# EAGLE design Escorna_CPU_2_01 (EAGLE 6.4)
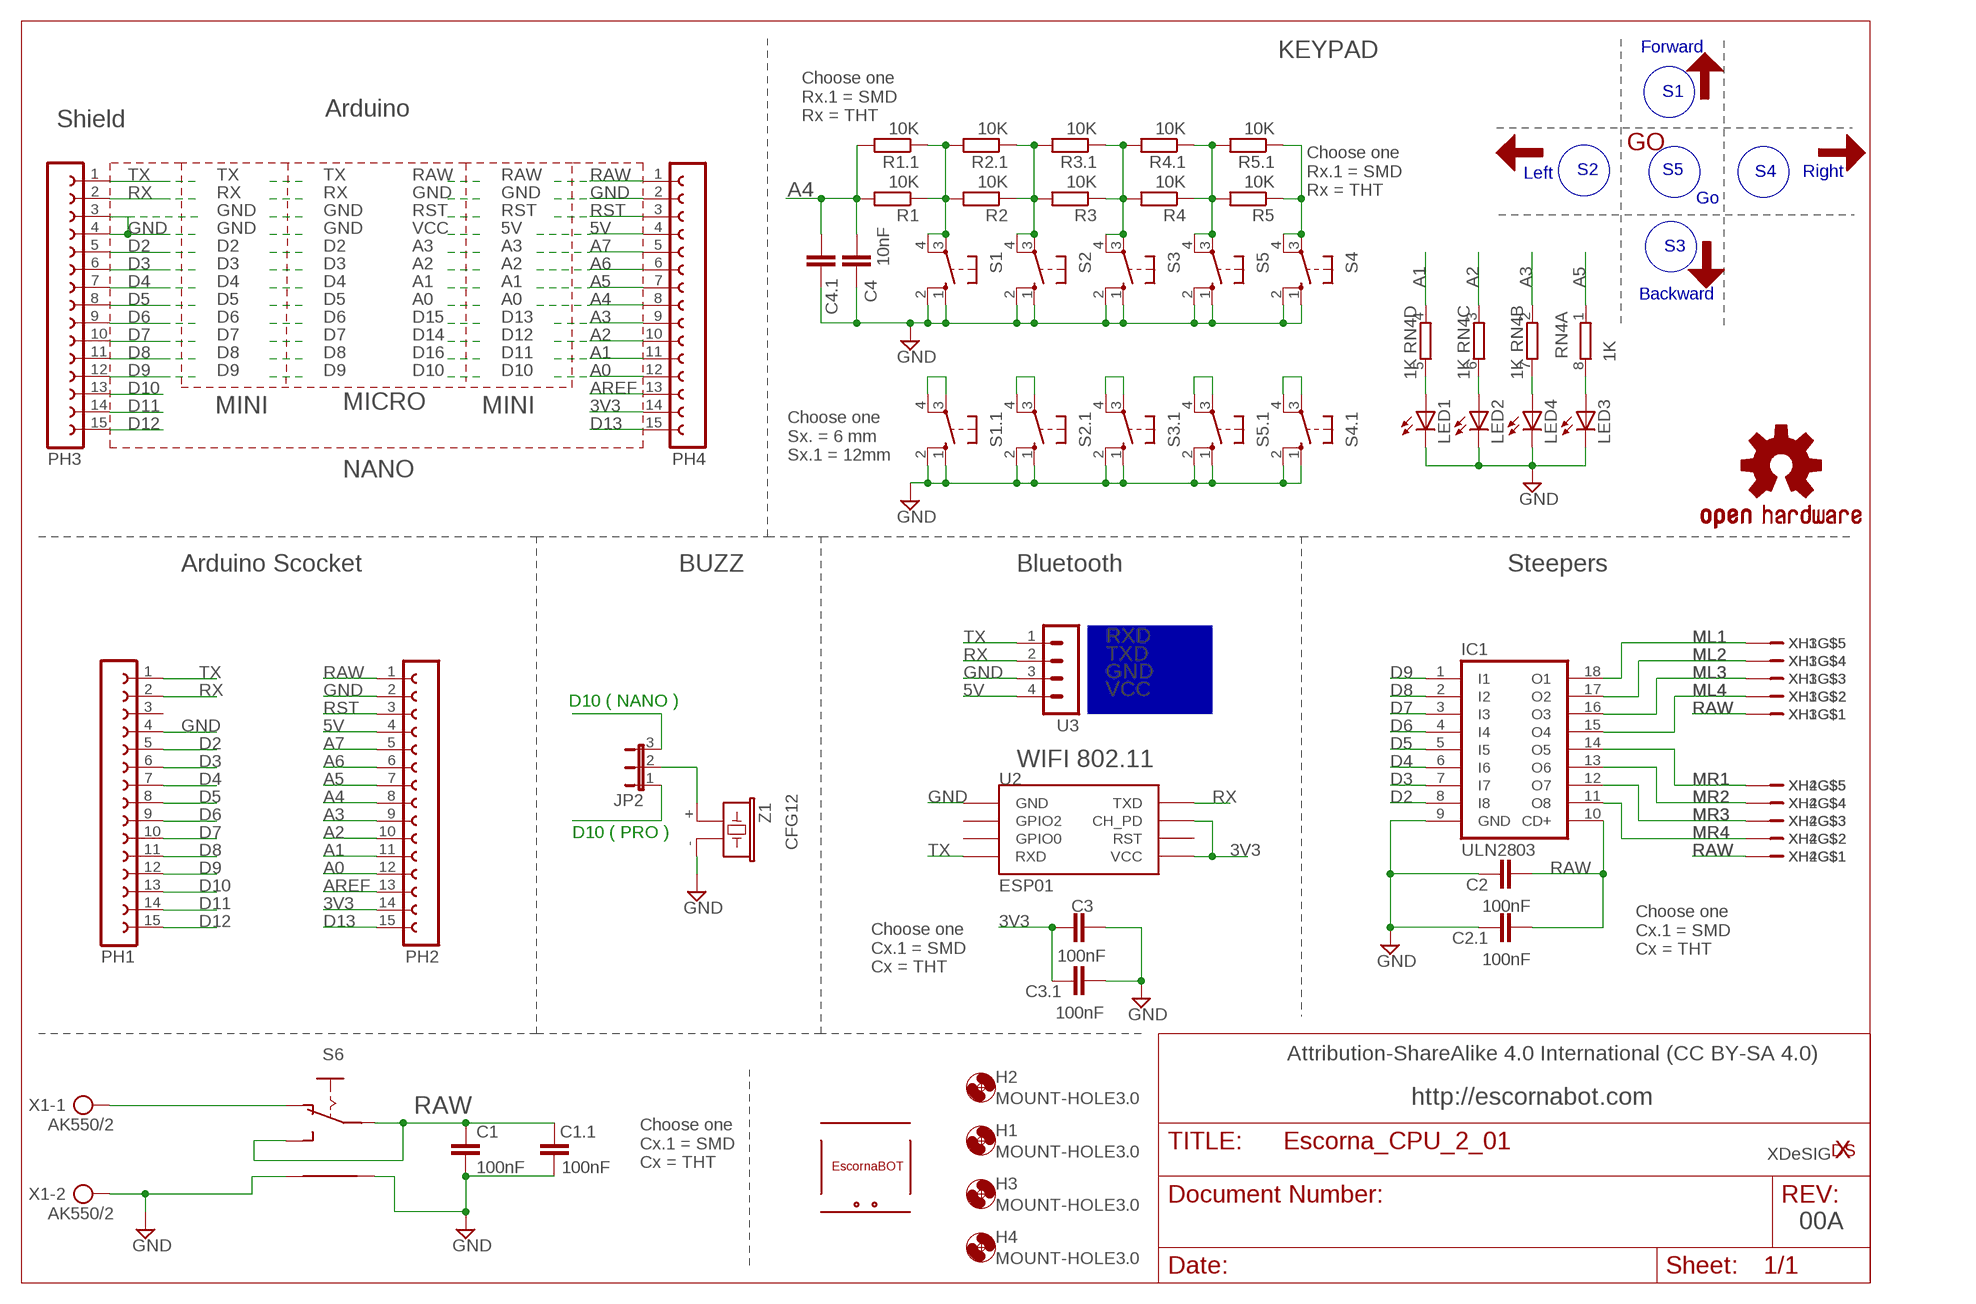
[diagram p0: schematic, sheet 1]

## Parts
C1  100nF  C-EU025-025X050  [C025-025X050]
C1.1  100nF  C-EUC0603  [C0603]
C2  100nF  C-EU025-025X050  [C025-025X050]
C2.1  100nF  C-EUC0603  [C0603]
C3  100nF  C-EU025-025X050  [C025-025X050]
C3.1  100nF  C-EUC0603  [C0603]
C4  10nF  C-EU025-025X050  [C025-025X050]
C4.1  10nF  C-EUC0603  [C0603]
ESC  ESCORNABOT  [ESCORNA_PEQUE]
H1  MOUNT-HOLE3.0  [3,0]
H2  MOUNT-HOLE3.0  [3,0]
H3  MOUNT-HOLE3.0  [3,0]
H4  MOUNT-HOLE3.0  [3,0]
IC1  ULN2803  ULN2803A"  [DIL18]
JP2  JP2E  [JP2]
LED1  LED_ESML0603  [LED_SML0603]
LED2  LED_ESML0603  [LED_SML0603]
LED3  LED_ESML0603  [LED_SML0603]
LED4  LED_ESML0603  [LED_SML0603]
LOGO2  OSHW-LOGOS  [OSHW-LOGO-S]
PH1  FE15-1  [FE15]
PH2  FE15-1  [FE15]
PH3  FE15-1  [FE15]
PH4  FE15-1  [FE15]
R1  10K  R-EU_0204/7  [0204/7]
R1.1  10K  R-EU_R0603  [R0603]
R2  10K  R-EU_0204/7  [0204/7]
R2.1  10K  R-EU_R0603  [R0603]
R3  10K  R-EU_0204/7  [0204/7]
R3.1  10K  R-EU_R0603  [R0603]
R4  10K  R-EU_0204/7  [0204/7]
R4.1  10K  R-EU_R0603  [R0603]
R5  10K  R-EU_0204/7  [0204/7]
R5.1  10K  R-EU_R0603  [R0603]
RN4  1K  4R-NCAY16  [CAY16]
S1  10-XX  [B3F-10XX]
S1.1  SWITCH-OMRON_40-XX  [SWITCH-OMRON_B3F40XX_NH]
S2  10-XX  [B3F-10XX]
S2.1  SWITCH-OMRON_40-XX  [SWITCH-OMRON_B3F40XX_NH]
S3  10-XX  [B3F-10XX]
S3.1  SWITCH-OMRON_40-XX  [SWITCH-OMRON_B3F40XX_NH]
S4  10-XX  [B3F-10XX]
S4.1  SWITCH-OMRON_40-XX  [SWITCH-OMRON_B3F40XX_NH]
S5  10-XX  [B3F-10XX]
S5.1  SWITCH-OMRON_40-XX  [SWITCH-OMRON_B3F40XX_NH]
S6  SK12F14D  [SK-12D07]
U2  ESP01  [ESP01]
U3  MA04-1  [MA04-1]
U$1  FRECHA  [FRECHA]
U$2  GO  [VALE]
U$3  FRECHA  [FRECHA]
U$6  FRECHA  [FRECHA]
U$11  FRECHA  [FRECHA]
X1  AK550/2  [AK550/2]
XDS1  XDESIG  [XDESIG_CU_2]
XH1  B5B-XH-A  [B5B-XH-A]
XH2  B5B-XH-A  [B5B-XH-A]
XH3  B5B-XH-A  [B5B-XH-A]
XH4  B5B-XH-A  [B5B-XH-A]
Z1  CFG12  F/CM12P  [F/CM12P]

## Nets
3V3: C3.1 C3.1.1 PH2.14 PH4.14 U2.CH_PD U2.VCC
5V: PH2.4 PH4.4 U3.4
A0: JP2.1 PH2.12 PH4.12
A1: PH2.11 PH4.11 RN4.4
A2: PH2.10 PH4.10 RN4.3
A3: PH2.9 PH4.9 RN4.2
A4: C4.1.2 C4.2 PH2.8 PH4.8 R1.1.2 R1.2
A5: PH2.7 PH4.7 RN4.1
A6: PH2.6 PH4.6
A7: PH2.5 PH4.5
AREF: PH2.13 PH4.13
D2: IC1.8(I8) PH1.5 PH3.5
D3: IC1.7(I7) PH1.6 PH3.6
D4: IC1.6(I6) PH1.7 PH3.7
D5: IC1.5(I5) PH1.8 PH3.8
D6: IC1.4(I4) PH1.9 PH3.9
D7: IC1.3(I3) PH1.10 PH3.10
D8: IC1.2(I2) PH1.11 PH3.11
D9: IC1.1(I1) PH1.12 PH3.12
D10: JP2.3 PH1.13 PH3.13
D11: PH1.14 PH3.14
D12: PH1.15 PH3.15
D13: PH2.15 PH4.15
GND: C1.1.1 C1.2 C2.1 C2.1.1 C3.1.2 C3.2 C4.1 C4.1.1 IC1.9(GND) LED1.C LED2.C LED3.C LED4.C PH1.4 PH2.2 PH3.3 PH3.4 PH4.2 S1.1(S) S1.1.1(S) S1.1.2(S1) S1.2(S1) S2.1(S) S2.1.1(S) S2.1.2(S1) S2.2(S1) S3.1(S) S3.1.1(S) S3.1.2(S1) S3.2(S1) S4.1(S) S4.1.1(S) S4.1.2(S1) S4.2(S1) S5.1(S) S5.1.1(S) S5.1.2(S1) S5.2(S1) S6.P$4 S6.P$5 U2.GND U3.3 X1.2 Z1.-
ML1: IC1.18(O1) XH1.P$5 XH3.P$5
ML2: IC1.17(O2) XH1.P$4 XH3.P$4
ML3: IC1.16(O3) XH1.P$3 XH3.P$3
ML4: IC1.15(O4) XH1.P$2 XH3.P$2
MR1: IC1.14(O5) XH2.P$5 XH4.P$5
MR2: IC1.13(O6) XH2.P$4 XH4.P$4
MR3: IC1.12(O7) XH2.P$3 XH4.P$3
MR4: IC1.11(O8) XH2.P$2 XH4.P$2
N$2: JP2.2 Z1.+
N$3: S6.P$2(O) X1.1
N$4: LED1.A RN4.5
N$5: LED2.A RN4.6
N$6: LED4.A RN4.7
N$7: LED3.A RN4.8
RAW: C1.1 C1.1.2 C2.1.2 C2.2 IC1.10(CD+) PH2.1 PH4.1 S6.P$1(P) S6.P$3(S) XH1.P$1 XH2.P$1 XH3.P$1 XH4.P$1
RST: PH2.3 PH4.3
RX: PH1.2 PH3.2 U2.TX(TXD) U3.2
S1: R1.1 R1.1.1 R2.1.2 R2.2 S1.1.3(P) S1.1.4(P1) S1.3(P) S1.4(P1)
S2: R2.1 R2.1.1 R3.1.2 R3.2 S2.1.3(P) S2.1.4(P1) S2.3(P) S2.4(P1)
S3: R3.1 R3.1.1 R4.1.2 R4.2 S3.1.3(P) S3.1.4(P1) S3.3(P) S3.4(P1)
S4: R4.1 R4.1.1 R5.1.2 R5.2 S5.1.3(P) S5.1.4(P1) S5.3(P) S5.4(P1)
S5: R5.1 R5.1.1 S4.1.3(P) S4.1.4(P1) S4.3(P) S4.4(P1)
TX: PH1.1 PH3.1 U2.RX(RXD) U3.1
Unconnected: PH1.3 U2.GPIO0 U2.GPIO2 U2.RST

## Notes on the sheet
- Forward
- KEYPAD
- S1
- Arduino
- Shield
- Choose one
  Rx.1 = SMD
  Rx = THT
- Left | S2 | S5 | S4 | Right
- TX | TX | RAW | RAW
- RX | RX | GND | GND
- Go
- Choose one
  Rx.1 = SMD
  Rx = THT
- GND | GND | RST | RST
- GND | GND | VCC | 5V
- D2 | D2 | A3 | A3 | S3
- D3 | D3 | A2 | A2
- D4 | D4 | A1 | A1
- Backward
- D5 | D5 | A0 | A0
- D6 | D6 | D15 | D13
- D7 | D7 | D14 | D12
- D8 | D8 | D16 | D11
- D9 | D9 | D10 | D10
- MINI | MINI
- MICRO
- NANO
- Choose one
  Sx. = 6 mm
  Sx.1 = 12mm
- Arduino Scocket | BUZZ | Bluetooth | Steepers
- RXD
- TXD
- GND
- VCC
- D10 ( NANO )
- WIFI 802.11
- D10 ( PRO )
- Choose one
  Cx.1 = SMD
  Cx = THT
- Choose one
  Cx.1 = SMD
  Cx = THT
- Attribution-ShareAlike 4.0 International (CC BY-SA 4.0)
- http://escornabot.com
- XDeSIG
- Choose one
  Cx.1 = SMD
  Cx = THT
- 00A

## Library data of the parts
C1 C1.1 C2 C2.1 C3 C3.1 C4 C4.1 = rcl:C-EU: CAPACITOR, European symbol
ESC = escorna:ESCORNABOT
H1-H4 = holes:MOUNT-HOLE: MOUNTING HOLE with drill center marker
IC1 = uln-udn:ULN2803A: DRIVER ARRAY
JP2 = jumper:JP2E: JUMPER
LED1-LED4 = eagle-ltspice:LED_E: LED Source: http://www.osram.convergy.de Source: www.luxeon.com Source: www.kingbright.com; SPICEMODEL: NONE; SPICEPREFIX: D; SPICETYPE: diode
LOGO2 = SparkFun-Aesthetics:OSHW-LOGO: Open Source Hardware Logo This logo indicates the piece of hardware it is found on incorporates a OSHW license and/or adheres to the definition of open source hardware found here: http://freedomdefined.org/OSHW
PH1-PH4 = con-lsta:FE15-1: FEMALE HEADER; OC_FARNELL: unknown; OC_NEWARK: unknown
R1 R1.1 R2 R2.1 R3 R3.1 R4 R4.1 R5 R5.1 = rcl:R-EU_: RESISTOR, European symbol
RN4 = resistor-dil:4R-N: Array Chip Resistor Source: RS Component / Phycomp; OC_FARNELL: unknown; OC_NEWARK: unknown
S1-S5 = switch-omron:10-XX: OMRON SWITCH; MPN: B3F-1000; OC_FARNELL: 176432; OC_NEWARK: 36M3542
S1.1 S2.1 S3.1 S4.1 S5.1 = Escorna_CPU_2_01:SWITCH-OMRON_40-XX: OMRON SWITCH
S6 = escorna:SK12F14
U2 = esp8266modules:ESP01: ESP8266 Wifi module 01
U3 = con-lstb:MA04-1: PIN HEADER; OC_FARNELL: unknown; OC_NEWARK: unknown
U$1 U$3 U$6 U$11 = escorna:FRECHA
U$2 = escorna:GO
X1 = con-ptr500:AK550/2: CONNECTOR; OC_FARNELL: unknown; OC_NEWARK: unknown
XDS1 = xdesig:XDESIG
XH1-XH4 = con-jst:B5B-XH-A
Z1 = buzzer:F/CM12P: BUZZER Source: Buerklin; OC_FARNELL: unknown; OC_NEWARK: unknown

## Net classes
0 default: width 0.254 mm, drill 0.61 mm, clearance 0.254 mm
1 power: width 0.254 mm, drill 0.61 mm, clearance 0.254 mm

## Board
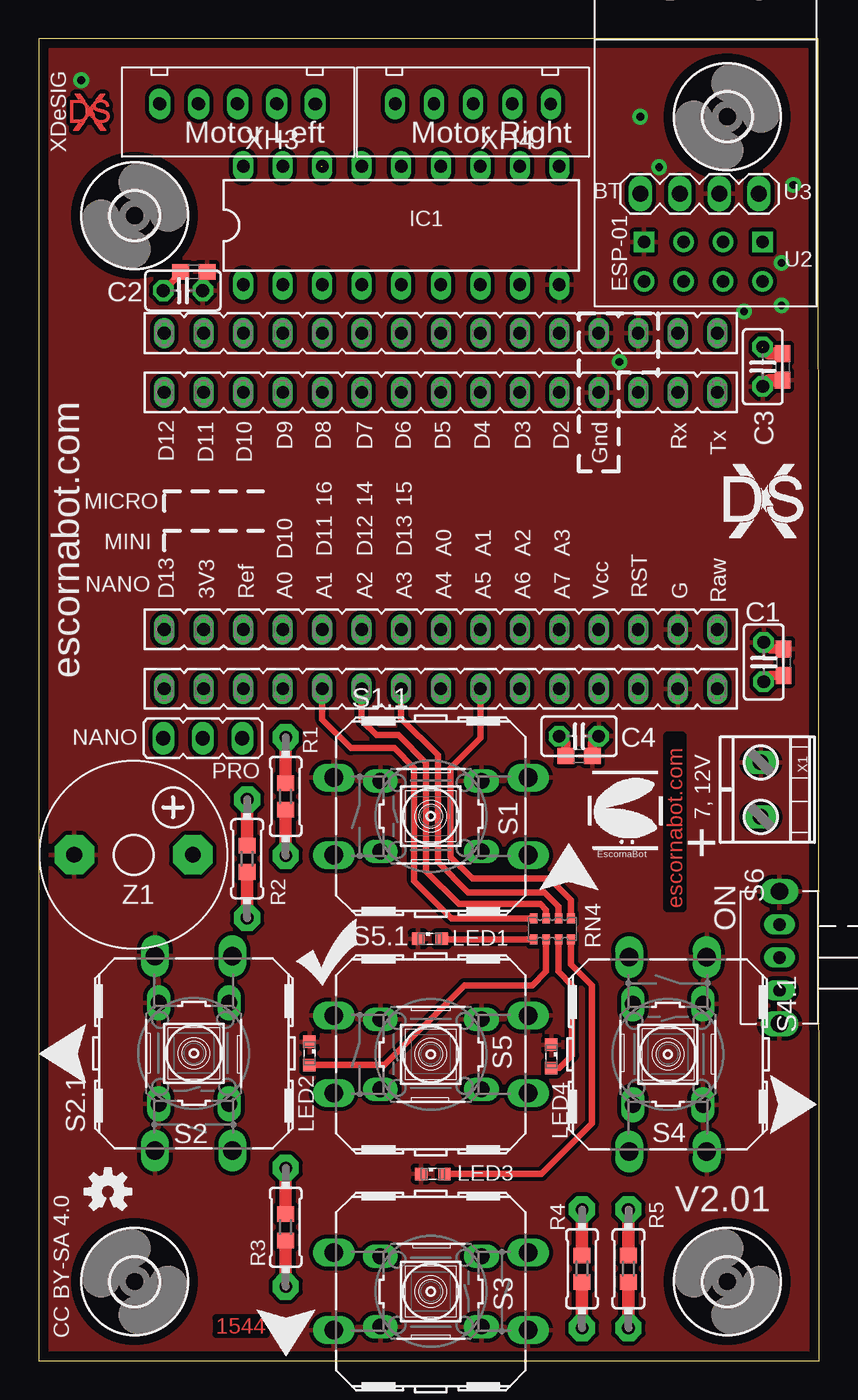
[diagram p1: board, top side]
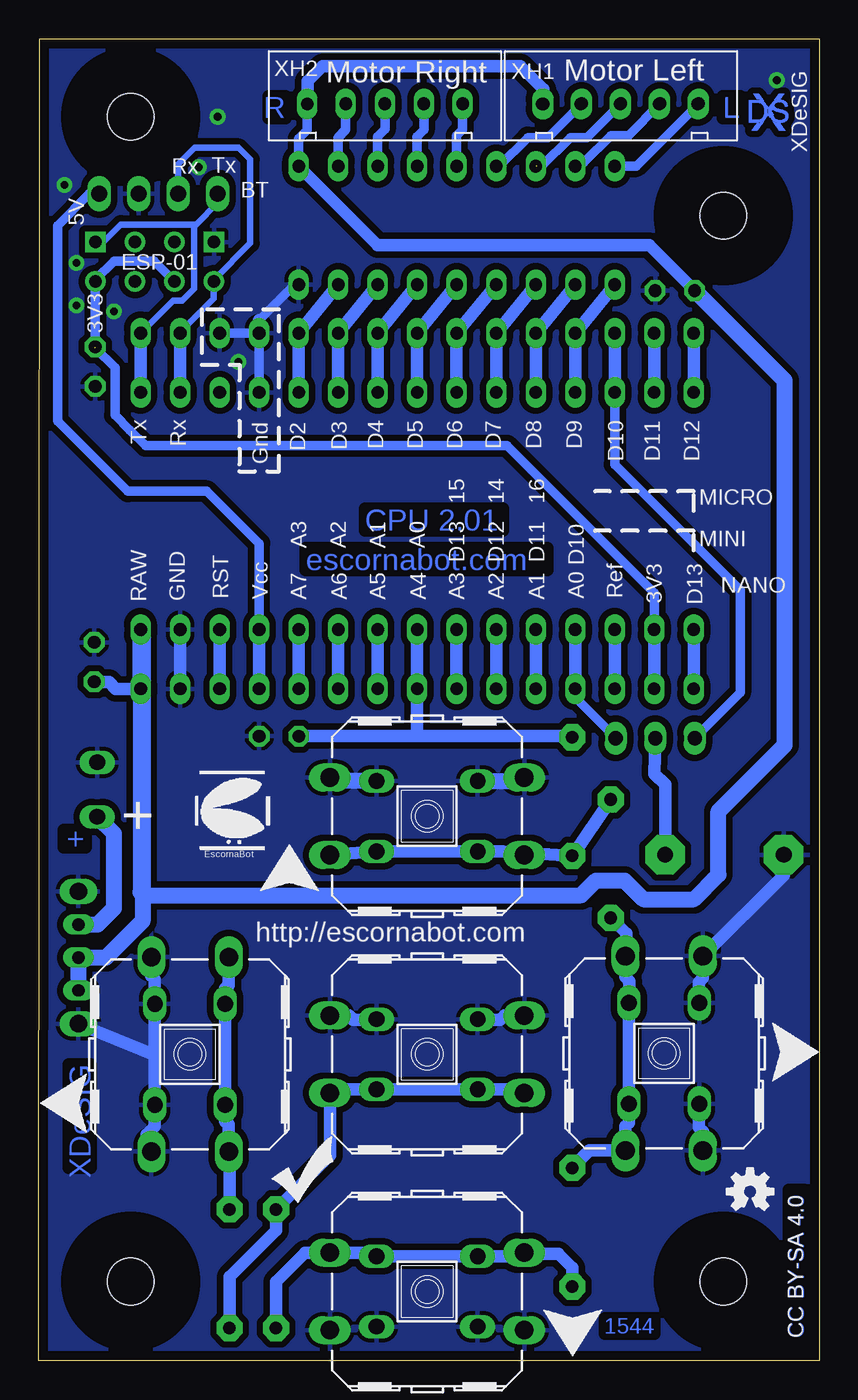
[diagram p2: board, bottom side, seen from below]

Size 50.16 x 84.95 mm. Coordinates in mm from the lower left corner, seen from the top.
Outline: 50.16,0 50.09,84.95 0,84.95 0,0 50.16,0
Copper layers (1*16): Top 0.035mm / dielectric 1.5mm / Bottom 0.035mm
Design rules "default *": minimum track width 10mil, minimum drill 22mil, track to track 10mil, track to pad 10mil, pad to pad 8mil, via to via 12mil, smd to smd 8mil, copper to edge 24mil, drill to drill 12mil, minimum pad ring 10mil, minimum via ring 10mil, stop-mask expansion 2mil, vias tented up to drill 30mil, thermal gap 10mil

### Footprints (pad centres in the part's own frame; a part is rotated, then mirrored left to right if it is on the bottom)
C025-025X050 = drill 0.813 octagon: 1 -1.27,0; 2 1.27,0
C0603 = smd 1.1 x 1: 1 -0.85,0; 2 0.85,0
3,0 = hole 3: 0,0
DIL18 = drill 0.813 long: 1 -10.16,-3.81; 2 -7.62,-3.81; 3 -5.08,-3.81; 4 -2.54,-3.81; 5 0,-3.81; 6 2.54,-3.81; 7 5.08,-3.81; 8 7.62,-3.81; 9 10.16,-3.81; 10 10.16,3.81; 11 7.62,3.81; 12 5.08,3.81; 13 2.54,3.81; 14 0,3.81; 15 -2.54,3.81; 16 -5.08,3.81; 17 -7.62,3.81; 18 -10.16,3.81
JP2 = drill 0.914 long: 1 -2.54,0; 2 0,0; 3 2.54,0
LED_SML0603 = smd 0.8 x 0.8: A 0.75,0; C -0.75,0
FE15 = drill 0.813 long: 1 -17.78,0; 2 -15.24,0; 3 -12.7,0; 4 -10.16,0; 5 -7.62,0; 6 -5.08,0; 7 -2.54,0; 8 0,0; 9 2.54,0; 10 5.08,0; 11 7.62,0; 12 10.16,0; 13 12.7,0; 14 15.24,0; 15 17.78,0
0204/7 = drill 0.813 pad 1.676 octagon: 1 -3.81,0; 2 3.81,0
R0603 = smd 1 x 1.1: 1 -0.85,0; 2 0.85,0
CAY16 = smd 0.5 x 0.65: 1 -1.2,-0.675; 2 -0.4,-0.675; 3 0.4,-0.675; 4 1.2,-0.675; 5 1.2,0.675; 6 0.4,0.675; 7 -0.4,0.675; 8 -1.2,0.675
B3F-10XX = drill 1.016 long: 1 -3.251,2.261; 2 3.251,2.261; 3 -3.251,-2.261; 4 3.251,-2.261
SWITCH-OMRON_B3F40XX_NH = drill 1.194 long: 1 -6.248,2.489; 2 6.248,2.489; 3 -6.248,-2.489; 4 6.248,-2.489
SK-12D07 = drill 0.8 long: P$1 0,0; P$2 2.115,0; P$3 -2.115,0 | drill 1.1 pad 1.422 long: P$4 -4.25,0; P$5 4.25,0
ESP01 = drill 0.8: CH_PD -1.285,-8.178; GPIO0 1.255,-5.638; GPIO2 -1.285,-5.638; RST 1.255,-8.178; TX -3.825,-8.178; VCC 3.795,-8.178 | drill 0.8 square: GND -3.825,-5.638; RX 3.795,-5.638
MA04-1 = drill 1.016 long: 1 -3.81,0; 2 -1.27,0; 3 1.27,0; 4 3.81,0
AK550/2 = drill 1 pad 1.5 long: 1 -1.75,0; 2 1.75,0
B5B-XH-A = drill 0.8 long: P$1 -5.17,-0.19; P$2 -2.69,-0.175; P$3 -0.175,-0.175; P$4 2.34,-0.175; P$5 4.83,-0.175
F/CM12P = drill 1.016 pad 2.54 octagon: + 3.81,0; - -3.81,0

### Placement (x,y rotation side)
C1  46.6,44.89 90 top
C1.1  47.87,44.89 270 top
C2  9.26,68.77 180 top
C2.1  9.96,69.98 180 top
C3  46.54,63.88 270 top
C3.1  47.81,63.88 270 top
C4  34.72,40.13 180 top
C4.1  34.72,38.86 180 top
ESC  40.19,32.77 0 bottom
H1  44.25,5.08 90 top
H2  6.15,5.08 90 top
H3  44.25,79.95 0 top
H4  6.15,73.6 0 top
IC1  23.29,72.96 0 top
JP2  10.53,40.01 180 top
LED1  25.14,27.11 0 top
LED2  17.39,19.75 270 top
LED3  25.33,12 0 top
LED4  32.95,19.56 270 top
LOGO1  OSHW-LOGOS  [OSHW-LOGO-S]  4.44,10.86 0 top
LOGO2  4.44,10.86 0 bottom
PH1  25.83,62.23 180 top
PH2  25.83,46.99 180 top
PH3  25.83,66.04 180 top
PH4  25.83,43.18 180 top
R1  15.87,36.26 90 top
R1.1  15.87,36.26 90 top
R2  13.39,32.26 90 top
R2.1  13.39,32.26 90 top
R3  15.87,8.57 90 top
R3.1  15.87,8.57 90 top
R4  34.91,5.91 270 top
R4.1  34.91,5.91 270 top
R5  37.9,5.91 270 top
R5.1  37.9,5.91 270 top
RN4  33.01,27.75 180 top
S1  25.2,34.99 0 top
S1.1  25.2,34.99 0 top
S2  9.96,19.75 90 top
S2.1  9.96,19.75 90 top
S3  25.2,4.45 180 top
S3.1  25.2,4.45 180 top
S4  40.44,19.68 270 top
S4.1  40.44,19.68 270 top
S5  25.2,19.68 0 top
S5.1  25.2,19.68 0 top
S6  47.62,25.91 90 top
U2  42.73,77.53 0 top
U3  42.47,74.99 0 top
U$1  47.04,18.48 180 bottom
U$2  35.23,10.1 0 bottom
U$3  3.04,17.91 0 bottom
U$4  FRECHA  [FRECHA]  13.96,3.3 270 top
U$5  ESCORNABOT  [ESCORNA_PEQUE]  35.23,32.77 0 top
U$6  17.77,3.3 270 bottom
U$7  FRECHA  [FRECHA]  46.98,14.54 0 top
U$8  FRECHA  [FRECHA]  35.99,30.23 90 top
U$9  FRECHA  [FRECHA]  3.04,21.65 180 top
U$10  GO  [VALE]  16.5,24.07 0 top
U$11  32.12,30.16 90 bottom
U$12  XDESIG_XDESIG21  [XDESIG_XDESIG]  44.06,52.9 0 top
X1  46.41,36.7 90 top
XDS  XDESIG  [XDESIG_CU_2]  2.02,79.06 0 top
XDS1  4.5,79.06 0 bottom
XH1  12.56,80.96 0 bottom
XH2  27.74,80.96 0 bottom
XH3  12.63,80.58 180 top
XH4  27.74,80.58 180 top
Z1  6.09,32.51 0 top

### Tracks (layer width: path | path; a pad name or v marks a point on that pad's centre or on a via)
3V3  (1 unrouted)
  Top 0.813: C3.1.1 46.96,64.73 C3.1
  Bottom 0.254: 44.44,59.69 44.31,59.82
  Bottom 0.61: U2.VCC 46.54,69.34 46.54,65.34 | U2.VCC 46.52,65.07 45.27,63.82 45.27,60.77 44.31,59.82 43.3,58.8 20.06,58.8 10.59,49.34 PH2.14 | U2.VCC 46.52,69.48 45.33,70.67 42.76,70.67 U2.CH_PD
  Bottom 0.813: PH4.14 PH2.14
5V
  Bottom 0.61: PH2.4 36,52.51 39.36,55.88 44.44,55.88 48.95,60.39 48.95,72.96 46.92,74.99 U3.4
  Bottom 0.813: PH2.4 PH4.4
A0
  Bottom 0.61: PH4.12 15.67,42.61 JP2.1
  Bottom 0.813: PH4.12 PH2.12
A1
  Top 0.406: RN4.4 26.54,28.42 24.12,30.84 24.12,38.1 22.85,39.37 20.06,39.37 18.21,41.21 PH4.11
  Bottom 0.813: PH2.11 PH4.11
A2
  Top 0.406: RN4.3 32.61,28.98 32.25,29.34 27,29.34 24.88,31.45 24.88,38.42 23.1,40.2 21.71,40.2 20.75,41.15 PH4.10
  Bottom 0.813: PH2.10 PH4.10
A3
  Top 0.406: PH4.9 23.29,41.27 25.64,38.92 25.64,32.04 27.58,30.1 32.5,30.1 33.41,29.19 RN4.2
  Bottom 0.813: PH2.9 PH4.9
A4
  Top 0.61: C4.1.2 33.88,39.71 C4.2
  Top 0.813: R1.1.2 R1.2
  Bottom 0.813: PH2.8 PH4.8 25.83,40.32 26.02,40.13 | C4.2 26.02,40.13 | 26.02,40.13 15.93,40.13 R1.2
A5
  Top 0.406: RN4.1 34.21,29.6 32.82,30.99 27.86,30.99 26.47,32.38 26.47,38.1 28.37,40.01 PH4.7
  Bottom 0.813: PH2.7 PH4.7
A6
  Bottom 0.813: PH2.6 PH4.6
A7
  Bottom 0.813: PH2.5 PH4.5
AREF
  Bottom 0.813: PH4.13 PH2.13
D2
  Bottom 0.813: IC1.8 PH3.5 PH1.5
D3
  Bottom 0.813: PH1.6 PH3.6 IC1.7
D4
  Bottom 0.813: IC1.6 PH3.7 PH1.7
D5
  Bottom 0.813: PH1.8 PH3.8 IC1.5
D6
  Bottom 0.813: PH1.9 PH3.9 IC1.4
D7
  Bottom 0.813: IC1.3 PH3.10 PH1.10
D8
  Bottom 0.813: IC1.2 PH3.11 PH1.11
D9
  Bottom 0.813: IC1.1 PH3.12 PH1.12
D10
  Bottom 0.61: PH1.13 13.13,57.59 5.07,49.53 5.07,42.93 JP2.3
  Bottom 0.813: PH3.13 PH1.13
D11
  Bottom 0.813: PH3.14 PH1.14
D12
  Bottom 0.813: PH3.15 PH1.15
D13
  Bottom 0.813: PH4.15 PH2.15
GND  (via drill 0.5 pad 0.25)
  Top 0.61: C1.1.1 47.02,45.74 C1.2 | C4.1.1 35.57,39.71 C4.1
  Top 0.813: C3.1.2 46.96,63.03 C3.2
  Bottom 0.61: PH3.3 PH3.4 PH1.4 | IC1.9 33.71,69.15 36,66.86
  Bottom 0.813: 36,66.86 PH3.4 | 43.23,13.53 43.23,14.54 42.73,15.05 42.73,19.68 | S4.1.1 42.93,24.71 42.73,24.51 42.73,22.99 | S2.1.1 7.47,14.72 7.74,14.99 7.74,16.46 S2.1 | S2.2 7.74,23.04 7.74,24.32 7.47,24.59 S2.1.2 2.28,31.19 Z1.- | S5.1.1 20.23,22.17 20.5,21.91 21.91,21.91 S5.1 | S5.1.2 30.23,22.17 29.96,21.91 28.49,21.91 S5.2 | 42.73,19.68 42.73,22.91 S4.1 | S6.P$4 42.75,19.66 42.73,19.68 | PH2.2 PH4.2
  Bottom 1.016: 42.8,23.16 S4.1 | S1.2 31.22,37.25 S1.1.2 | S1.1 19.18,37.25 S1.1.1
  other vias: 38.66,79.95 47.74,70.55 2.72,82.3 45.33,67.44 48.5,75.56 37.33,64.2 39.87,76.71 47.74,67.82
  pour Bottom (isolate 0.406): -1.28,86.36 50.79,86.36 50.79,-1.27 -1.28,-1.27
  pour Top: -0.01,87.63 50.79,87.63 50.79,0 -0.01,0
ML1
  Bottom 0.406: XH1.P$5 XH3.P$5
  Bottom 0.61: IC1.18 11.75,76.77 XH1.P$5
ML2
  Bottom 0.406: XH1.P$4 XH3.P$4
  Bottom 0.61: XH1.P$4 12.27,78.74 13.39,78.74 15.1,77.03 15.42,77.03 IC1.17
ML3  (1 unrouted)
  Top 0.254: 12.69,80.01 XH1.P$3
  Bottom 0.406: XH1.P$3 XH3.P$3
  Bottom 0.61: 18.15,76.77 17.83,76.77 15.99,78.61 14.91,78.61 XH1.P$3
ML4
  Bottom 0.406: XH1.P$2 XH3.P$2
  Bottom 0.61: IC1.15 20.56,76.77 18.72,78.61 17.43,78.61 XH1.P$2
MR1
  Bottom 0.61: XH2.P$5 XH4.P$5 22.91,79.12 23.29,78.74 IC1.14
MR2
  Bottom 0.61: XH2.P$4 XH4.P$4 25.4,79.11 25.83,78.68 IC1.13
MR3
  Bottom 0.61: XH2.P$3 XH4.P$3 27.91,79.14 28.37,78.68 IC1.12
MR4
  Bottom 0.61: XH2.P$2 XH4.P$2 30.43,79.1 30.91,78.61 IC1.11
N$2
  Bottom 0.813: JP2.2 10.59,37.72 9.9,37.02 Z1.+
N$3
  Bottom 1.016: S6.P$2 46.39,28.02 45.33,29.08 45.33,33.87 X1.1
N$4
  Top 0.406: RN4.5 25.93,27.07 LED1.A
N$5
  Top 0.406: RN4.6 32.61,25 31.74,24.13 27.36,24.13 22.23,19 LED2.A
N$6
  Top 0.406: RN4.7 33.41,25 34.28,24.13 34.28,19.62 33.47,18.81 LED4.A
N$7
  Top 0.406: RN4.8 34.21,25.47 35.55,24.13 35.55,15.24 32.31,12 LED3.A
RAW
  Top 0.254: 33.01,81.28 XH4.P$1 33.01,81.28
  Top 0.406: 8.09,68.77 C2.1.2
  Top 0.61: C1.1.2 47.02,44.04 C1.1
  Top 0.813: C2.2 8.09,68.77
  Bottom 0.61: XH4.P$1 32.91,79.09 33.46,78.55 IC1.10
  Bottom 0.813: 32.97,80.83 XH4.P$1 32.88,80.8 32.88,82.23 31.93,83.19 19.19,83.19 17.73,81.73 XH3.P$1 XH1.P$1 | PH4.1 45.2,43.18 45.65,43.62 C1.1 | C2.2 10.91,71.69 28.37,71.69 IC1.10
  Bottom 1.016: S6.P$3 S6.P$1 45.84,25.91 43.49,28.26 43.49,29.91 | 43.61,30.1 PH4.1 PH2.1 43.49,46.99 43.49,29.91 | 43.49,29.91 15.29,29.91 14.34,30.86 12.5,30.86 11.29,29.65 8.05,29.65 6.47,31.24 6.47,35.31 2.21,39.56 2.21,62.99 C2.2
RST
  Bottom 0.813: PH2.3 PH4.3
RX
  Bottom 0.406: U3.2 41.2,76.9 40.15,77.95 37.3,77.95 36.57,77.22 36.57,71.82 38.9,69.48 U2.TX 38.91,69.34 38.91,68.26 40.95,66.23 40.95,66.04 PH3.2
  Bottom 0.813: PH3.2 PH1.2
S1
  Top 0.813: R1.1.1 R1.1 | R2.1.2 R2.2
  Bottom 0.813: R2.2 R1.1 20.33,32.73 | 20.33,32.73 S1.3 S1.4 S1.1.4 | S1.1.3 20.33,32.73
S2
  Top 0.813: R2.1.1 R2.1 | R3.1.2 R3.2
  Bottom 0.813: R2.1 12.38,27.45 S2.1.4 12.45,24.65 12.18,24.38 12.18,23.04 S2.4 S2.3 12.22,15.27 12.44,15.05 12.44,13.51 S2.1.3 14.75,13.5 R3.2
S3
  Top 0.813: R3.1.1 R3.1 | R4.1.2 R4.2
  Bottom 0.813: S3.3 28.73,6.71 | R3.1 15.87,5.97 16.75,6.86 18.88,6.86 S3.1.4 19.18,6.71 S3.4 S3.3 | S3.3 28.68,6.93 S3.1.3 33.04,6.93 R4.1.2 R4.2
S4
  Top 0.813: R4.1.1 R4.1 | R5.1.2 R5.2
  Bottom 0.813: R5.2 37.9,5.4 34.91,8.38 R4.1 31.45,13.18 S5.1.4 31.22,17.42 S5.4 S5.3 19.18,17.42 S5.1.3
S5
  Top 0.813: R5.1.1 R5.1
  Bottom 0.813: S4.1.3 37.96,25.92 37.96,24.13 38.18,23.91 S4.3 S4.4 38.18,15.39 37.96,15.18 37.96,13.45 S4.1.4 37.9,13.39 R5.1
TX
  Bottom 0.406: U3.1 38.66,74.42 40.06,73.03 40.19,73.03 | U2.RX 46.01,71.9 44.89,73.03 40.19,73.03 | 40.19,73.03 40.19,68.9 40.95,68.14 41.52,68.14 PH3.1
  Bottom 0.813: PH3.1 PH1.1

### Text on the board
Top: escornabot.com | 1544
Bottom: L | R | CPU 2.01 | escornabot.com | + | XDeSIG | 1544 | CC BY-SA 4.0
tPlace: Motor Left | Motor Right | XDeSIG | BT | ESP-01 | Tx | D9 | D8 | D7 | D6 | D5 | D4 | D3 | D2 | Rx | D12 | D11 | D10 | Gnd | MICRO | 16 | 14 | 15 | MINI | D11 | D12 | D13 | A0 | A1 | A2 | A3 | D10 | NANO | D13 | 3V3 | Ref | A0 | A1 | A2 | A3 | A4 | A5 | A6 | A7 | Vcc | RST | G | Raw | escornabot.com | NANO | PRO | 7, 12V | + | ON | V2.01 | CC BY-SA 4.0
bPlace: Motor Left | Motor Right | XDeSIG | Tx | Rx | BT | 5V | ESP-01 | 3V3 | Rx | Tx | D12 | D11 | D10 | D9 | D8 | D7 | D6 | D5 | D4 | D3 | D2 | Gnd | 16 | 14 | 15 | MICRO | D10 | D11 | D12 | D13 | A0 | A1 | A2 | A3 | MINI | D13 | 3V3 | Ref | A0 | A1 | A2 | A3 | A4 | A5 | A6 | A7 | Vcc | NANO | RST | GND | RAW | + | http://escornabot.com | CC BY-SA 4.0
Measures: Attribution-ShareAlike 4.0 International (CC BY-SA 4.0)
tDocu: Attribution-ShareAlike 4.0 International (CC BY-SA 4.0)